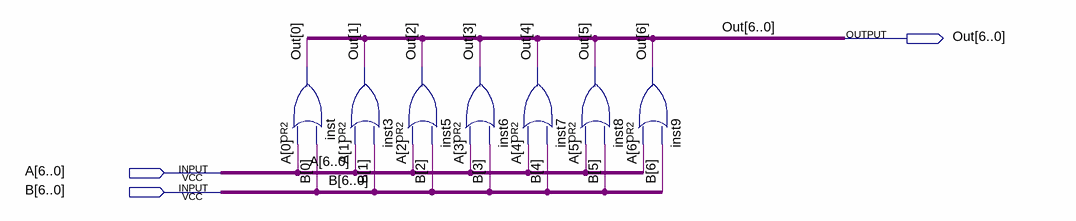
[diagram p0: schematic sheet]
// Quartus schematic BUSSUM5.bdf as structural Verilog: 7 symbols, 3 pins
module BUSSUM5 (
  input  [6:0] A,
  input  [6:0] B,
  output [6:0] Out
);

  or inst (Out[0], A[0], B[0]);
  or inst3 (Out[1], A[1], B[1]);
  or inst5 (Out[2], A[2], B[2]);
  or inst6 (Out[3], A[3], B[3]);
  or inst7 (Out[4], A[4], B[4]);
  or inst8 (Out[5], A[5], B[5]);
  or inst9 (Out[6], A[6], B[6]);
endmodule
